# EAGLE schematic pianotiles (EAGLE 7.6.0)
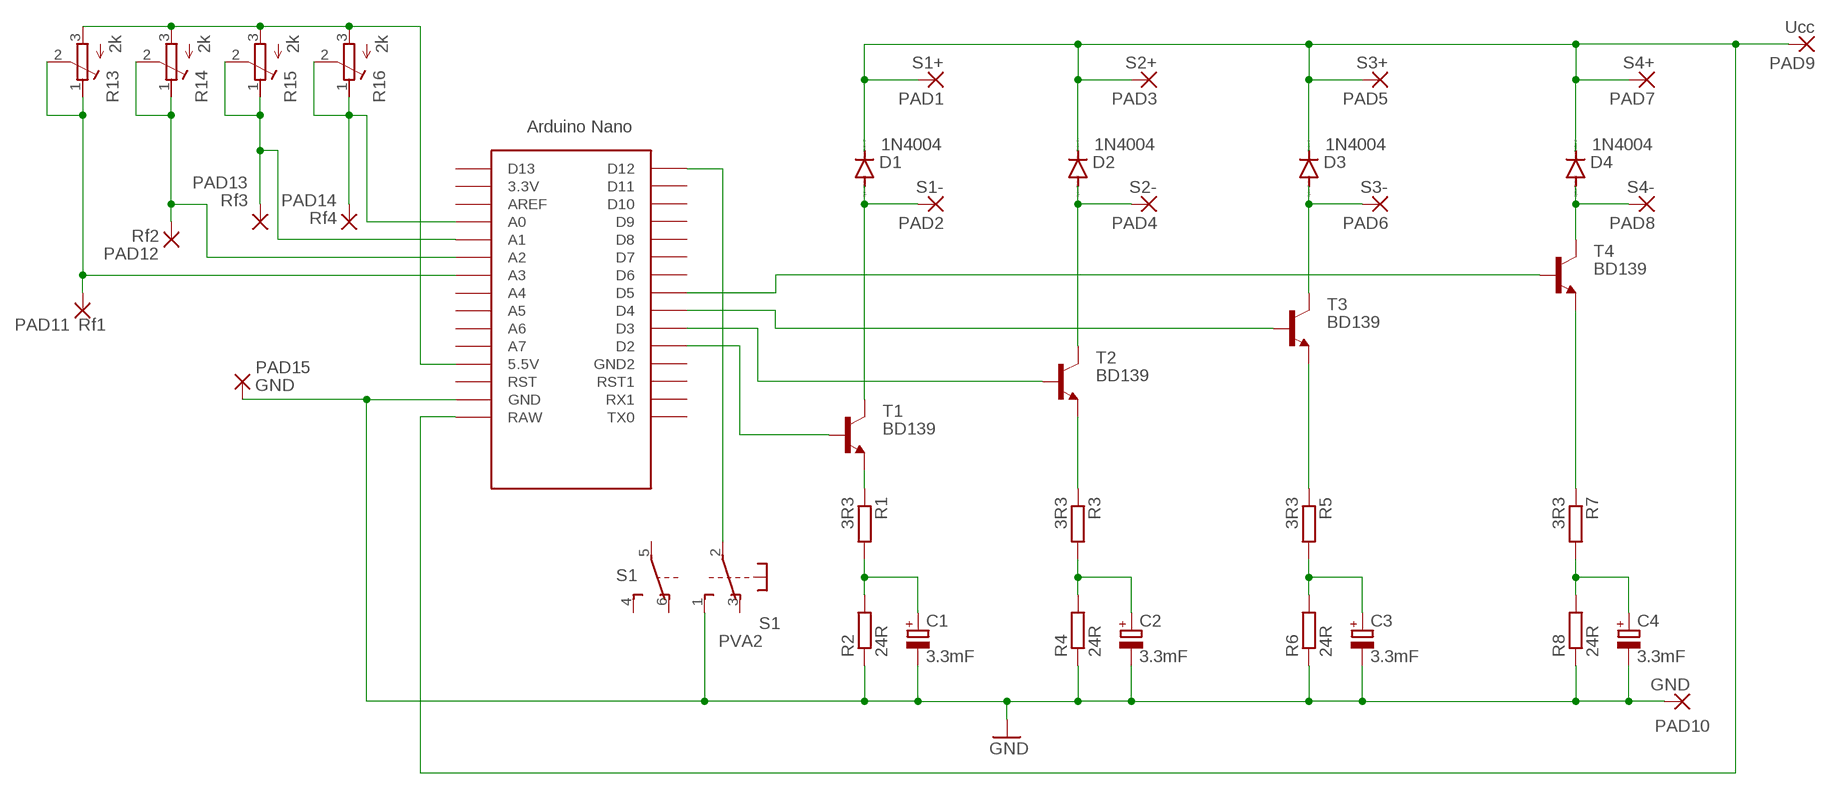
[diagram p0: schematic, sheet 1]

## Parts
C1  3.3mF  CPOL-EUE5-10.5  [E5-10,5]
C2  3.3mF  CPOL-EUE5-10.5  [E5-10,5]
C3  3.3mF  CPOL-EUE5-10.5  [E5-10,5]
C4  3.3mF  CPOL-EUE5-10.5  [E5-10,5]
D1  1N4004  [DO41-10]
D2  1N4004  [DO41-10]
D3  1N4004  [DO41-10]
D4  1N4004  [DO41-10]
PAD1  S1+  2,15/1,0  [2,15/1,0]
PAD2  S1-  2,15/1,0  [2,15/1,0]
PAD3  S2+  2,15/1,0  [2,15/1,0]
PAD4  S2-  2,15/1,0  [2,15/1,0]
PAD5  S3+  2,15/1,0  [2,15/1,0]
PAD6  S3-  2,15/1,0  [2,15/1,0]
PAD7  S4+  2,15/1,0  [2,15/1,0]
PAD8  S4-  2,15/1,0  [2,15/1,0]
PAD9  Ucc  2,54/1,0  [2,54/1,0]
PAD10  GND  2,54/1,0  [2,54/1,0]
PAD11  Rf1  2,15/1,0  [2,15/1,0]
PAD12  Rf2  2,15/1,0  [2,15/1,0]
PAD13  Rf3  2,15/1,0  [2,15/1,0]
PAD14  Rf4  2,15/1,0  [2,15/1,0]
PAD15  GND  2,15/1,0  [2,15/1,0]
R1  3R3  R-EU_0309/10  [0309/10]
R2  24R  R-EU_0309/10  [0309/10]
R3  3R3  R-EU_0309/10  [0309/10]
R4  24R  R-EU_0309/10  [0309/10]
R5  3R3  R-EU_0309/10  [0309/10]
R6  24R  R-EU_0309/10  [0309/10]
R7  3R3  R-EU_0309/10  [0309/10]
R8  24R  R-EU_0309/10  [0309/10]
R13  2k  R-TRIMMT93YA  [RTRIMT93YA]
R14  2k  R-TRIMMT93YA  [RTRIMT93YA]
R15  2k  R-TRIMMT93YA  [RTRIMT93YA]
R16  2k  R-TRIMMT93YA  [RTRIMT93YA]
S1  PVA2  [PVA2F]
T1  BD139  [TO126]
T2  BD139  [TO126]
T3  BD139  [TO126]
T4  BD139  [TO126]
U$1  NANO  [NANO]

## Nets
GND: C1.- C2.- C3.- C4.- PAD10.1(P) PAD15.1(P) R2.1 R4.1 R6.1 R8.1 S1.1(1:S) U$1.GND
N$1: C2.+ R3.2 R4.2
N$2: C1.+ R1.2 R2.2
N$3: R1.1 T1.1(E)
N$4: R3.1 T2.1(E)
N$5: T4.3(B) U$1.D5
N$6: D2.A PAD4.1(P) T2.2(C)
N$7: T3.3(B) U$1.D4
N$8: C3.+ R5.2 R6.2
N$9: R5.1 T3.1(E)
N$10: T2.3(B) U$1.D3
N$11: D3.A PAD6.1(P) T3.2(C)
N$12: PAD11.1(P) R13.1(E) R13.2(S) U$1.A3
N$13: D1.C D2.C D3.C D4.C PAD1.1(P) PAD3.1(P) PAD5.1(P) PAD7.1(P) PAD9.1(P) U$1.RAW
N$14: D1.A PAD2.1(P) T1.2(C)
N$15: S1.2(1:P) U$1.D12
N$16: C4.+ R7.2 R8.2
N$17: R7.1 T4.1(E)
N$18: T1.3(B) U$1.D2
N$19: D4.A PAD8.1(P) T4.2(C)
N$20: PAD12.1(P) R14.1(E) R14.2(S) U$1.A2
N$21: PAD13.1(P) R15.1(E) R15.2(S) U$1.A1
N$22: PAD14.1(P) R16.1(E) R16.2(S) U$1.A0
N$23: R13.3(A) R14.3(A) R15.3(A) R16.3(A) U$1.5V(5.5V)
Unconnected: S1.3(1:O) S1.4(2:S) S1.5(2:P) S1.6(2:O) U$1.3.3V U$1.A4 U$1.A5 U$1.A6 U$1.A7 U$1.AREF U$1.D6 U$1.D7 U$1.D8 U$1.D9 U$1.D10 U$1.D11 U$1.D13 U$1.GND1(GND2) U$1.ICSP1 U$1.ICSP2 U$1.ICSP3 U$1.ICSP4 U$1.ICSP5 U$1.ICSP6 U$1.RST U$1.RST1 U$1.RX1 U$1.TX0

## Library data of the parts
C1-C4 = rcl:CPOL-EU: POLARIZED CAPACITOR, European symbol; SPICEPREFIX: C
D1-D4 = diode:1N4004: DIODE general purpose rectifier, 1 A
PAD1-PAD8 PAD11-PAD15 = wirepad:2,15/1,0: THROUGH-HOLE PAD
PAD9 PAD10 = wirepad:2,54/1,0: THROUGH-HOLE PAD
R1-R8 = rcl:R-EU_: RESISTOR, European symbol; SPICEPREFIX: R
R13-R16 = rcl:R-TRIMM: Trimm resistor; SPICEMODEL: X; SPICEPREFIXL: POT
S1 = switch-misc:PVA2: ITT SWITCH
T1-T4 = transistor:BD139: NPN TRANSISTOR
U$1 = Arduino-clone:NANO: Arduino Nano

## Net classes
0 default: width 0.889 mm